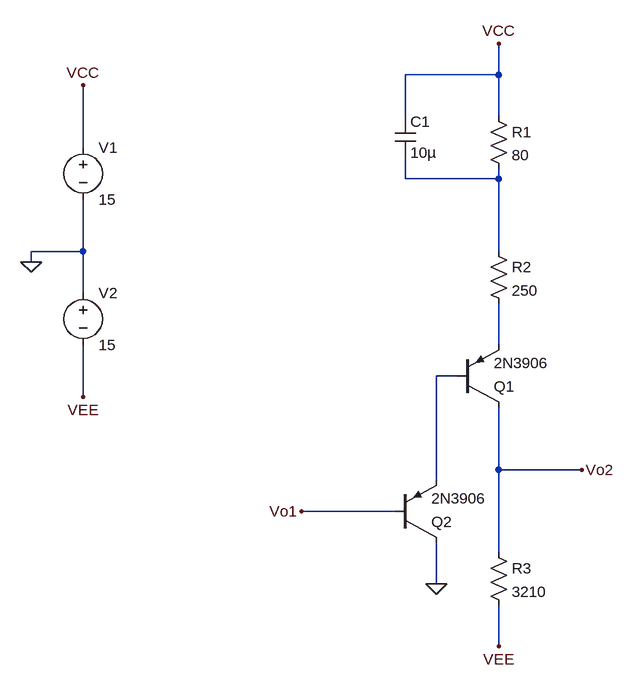
[diagram p0: schematic LT_ETAGE_2.asc]
LT_ETAGE_2.asc, the LTspice schematic file:
Version 4
SHEET 1 880 972
WIRE 112 0 112 -48
WIRE 112 0 -32 0
WIRE -32 64 -32 0
WIRE 112 64 112 0
WIRE -528 112 -528 16
WIRE -32 160 -32 128
WIRE 112 160 112 144
WIRE 112 160 -32 160
WIRE -528 272 -528 192
WIRE -528 272 -608 272
WIRE 112 272 112 160
WIRE -608 288 -608 272
WIRE -528 336 -528 272
WIRE 112 416 112 352
WIRE 48 464 16 464
WIRE -528 496 -528 416
WIRE 112 608 112 512
WIRE 240 608 112 608
WIRE 16 624 16 464
WIRE -48 672 -192 672
WIRE 112 736 112 608
WIRE 16 784 16 720
WIRE 112 880 112 816
FLAG 16 784 0
FLAG -192 672 Vo1
FLAG 240 608 Vo2
FLAG 112 -48 VCC
FLAG 112 880 VEE
FLAG -608 288 0
FLAG -528 16 VCC
FLAG -528 496 VEE
SYMBOL res 96 48 R0
SYMATTR InstName R1
SYMATTR Value 80
SYMBOL res 96 256 R0
SYMATTR InstName R2
SYMATTR Value 250
SYMBOL cap -48 64 R0
SYMATTR InstName C1
SYMATTR Value 10µ
SYMBOL pnp 48 512 M180
SYMATTR InstName Q1
SYMATTR Value 2N3906
SYMBOL pnp -48 720 M180
SYMATTR InstName Q2
SYMATTR Value 2N3906
SYMBOL res 96 720 R0
SYMATTR InstName R3
SYMATTR Value 3210
SYMBOL voltage -528 96 R0
SYMATTR InstName V1
SYMATTR Value 15
SYMBOL voltage -528 320 R0
SYMATTR InstName V2
SYMATTR Value 15

The netlist it stands for:
* LT_ETAGE_2.asc
R1 VCC N001 80
R2 N001 N002 250
C1 VCC N001 10µ
Q1 Vo2 N003 N002 0 2N3906
Q2 0 Vo1 N003 0 2N3906
R3 Vo2 VEE 3210
V1 VCC 0 15
V2 0 VEE 15
.model NPN NPN
.model PNP PNP
.lib standard.bjt
.backanno
.end